# EAGLE design Oled v1.0 (EAGLE 5.10)
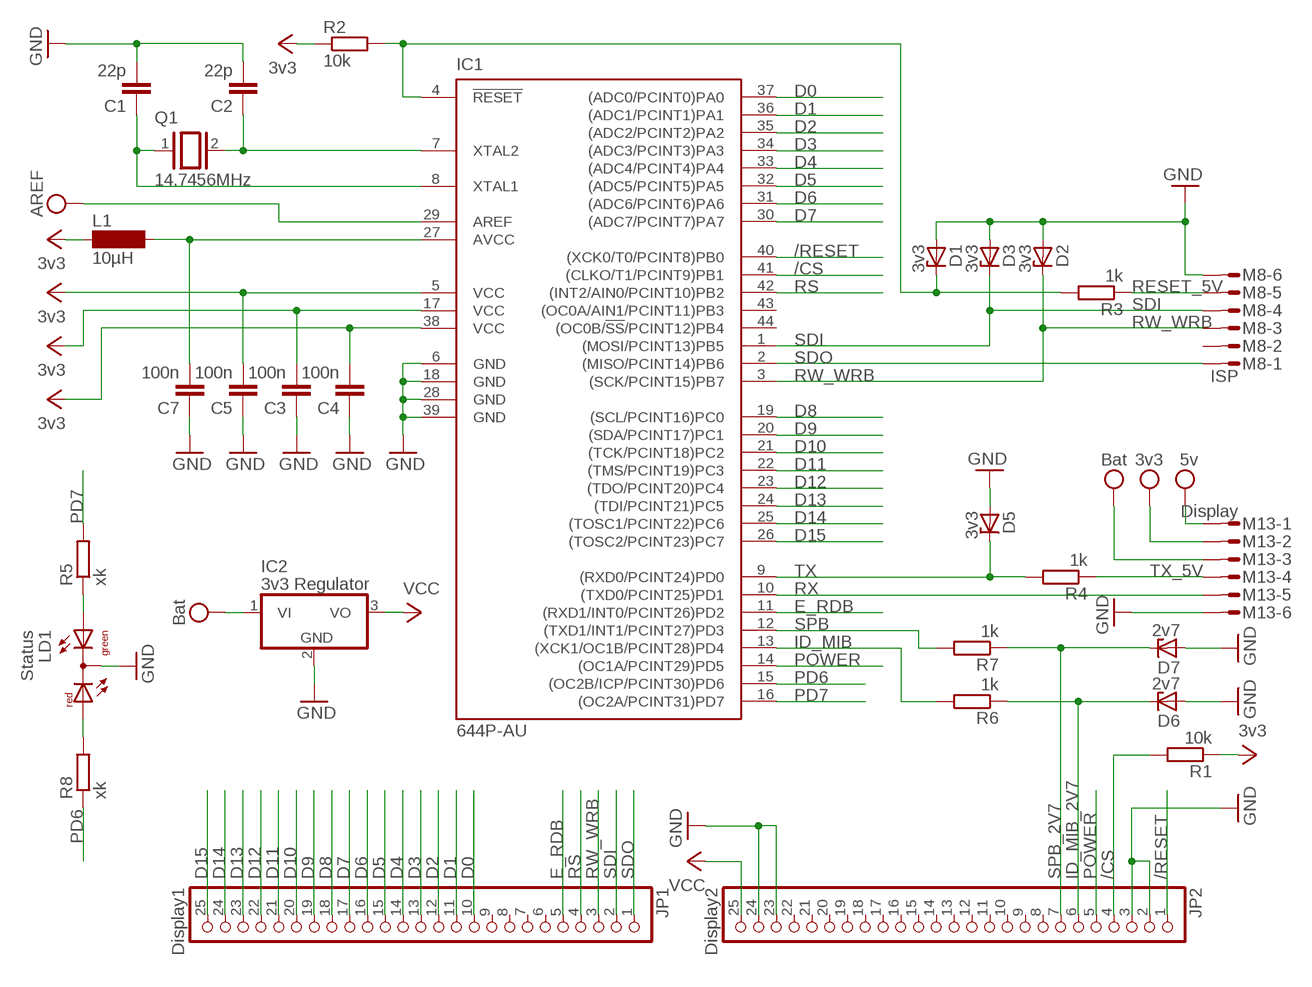
[diagram p0: schematic, sheet 1]

## Parts
C1  22p  C-EUC0603  [C0603]
C2  22p  C-EUC0603  [C0603]
C3  100n  C-EUC0603  [C0603]
C4  100n  C-EUC0603  [C0603]
C5  100n  C-EUC0603  [C0603]
C7  100n  C-EUC0603  [C0603]
D1  3v3  ZENER-DIODESOT23  [SOT23]
D2  3v3  ZENER-DIODESOT23  [SOT23]
D3  3v3  ZENER-DIODESOT23  [SOT23]
D5  3v3  ZENER-DIODESOT23  [SOT23]
D6  2v7  ZENER-DIODESOT23  [SOT23]
D7  2v7  ZENER-DIODESOT23  [SOT23]
IC1  644P-AU  MEGA164P/324P/644P-AU  [TQFP44]
IC2  3v3 Regulator  7805T  [TO220H]
JP1  Display1  PINHD-1X25  [1X25]
JP2  Display2  PINHD-1X25  [1X25]
L1  10µH  SM-1206  [SM-1206]
LD1  Status  DUOLED-RG-C  [DUOLED-C-5MM]
M8  ISP  MICROMATCH-6  [MICROMATCH-6]
M13  Display  MICROMATCH-6  [MICROMATCH-6]
Q1  14.7456MHz  XTAL/S  [QS]
R1  10k  R-EU_R0603  [R0603]
R2  10k  R-EU_R0603  [R0603]
R3  1k  R-EU_R0603  [R0603]
R4  1k  R-EU_R0603  [R0603]
R5  xk  R-EU_R0603  [R0603]
R6  1k  R-EU_R0603  [R0603]
R7  1k  R-EU_R0603  [R0603]
R8  xk  R-EU_R0603  [R0603]

## Nets
3V3: C3.2 C4.2 C5.2 IC1.5(VCC) IC1.17(VCC) IC1.38(VCC) L1.1 M13.2 R1.1 R2.1 ; supply symbol labelled 3v3
5V: M13.1 ; supply symbol labelled 5v
/CS: IC1.41((CLKO/T1/PCINT9)PB1) JP2.4 R1.2
/RESET: IC1.40((XCK0/T0/PCINT8)PB0) JP2.1
AREF: IC1.29(AREF)
AVCC: C7.2 IC1.27(AVCC) L1.2
BAT: IC2.1(VI) M13.3 ; supply symbol labelled Bat
D0: IC1.37((ADC0/PCINT0)PA0) JP1.10
D1: IC1.36((ADC1/PCINT1)PA1) JP1.11
D2: IC1.35((ADC2/PCINT2)PA2) JP1.12
D3: IC1.34((ADC3/PCINT3)PA3) JP1.13
D4: IC1.33((ADC4/PCINT4)PA4) JP1.14
D5: IC1.32((ADC5/PCINT5)PA5) JP1.15
D6: IC1.31((ADC6/PCINT6)PA6) JP1.16
D7: IC1.30((ADC7/PCINT7)PA7) JP1.17
D8: IC1.19((SCL/PCINT16)PC0) JP1.18
D9: IC1.20((SDA/PCINT17)PC1) JP1.19
D10: IC1.21((TCK/PCINT18)PC2) JP1.20
D11: IC1.22((TMS/PCINT19)PC3) JP1.21
D12: IC1.23((TDO/PCINT20)PC4) JP1.22
D13: IC1.24((TDI/PCINT21)PC5) JP1.23
D14: IC1.25((TOSC1/PCINT22)PC6) JP1.24
D15: IC1.26((TOSC2/PCINT23)PC7) JP1.25
E_RDB: IC1.11((RXD1/INT0/PCINT26)PD2) JP1.5
GND: C1.2 C2.2 C3.1 C4.1 C5.1 C7.1 D1.1(A) D2.1(A) D3.1(A) D5.1(A) D6.1(A) D7.1(A) IC1.6(GND) IC1.18(GND) IC1.28(GND) IC1.39(GND) IC2.2(GND) JP2.2 JP2.3 JP2.23 JP2.24 LD1.C M8.6 M13.6
ID_MIB: IC1.13((XCK1/OC1B/PCINT28)PD4) R6.2
ID_MIB_2V7: D6.3(C) JP2.6 R6.1
N$1: LD1.AR R8.2
N$2: LD1.AX(AG) R5.1
PD6: IC1.15((OC2B/ICP/PCINT30)PD6) R8.1
PD7: IC1.16((OC2A/PCINT31)PD7) R5.2
POWER: IC1.14((OC1A/PCINT29)PD5) JP2.5
RESET: D1.3(C) IC1.4(!RESET) R2.2 R3.2
RESET_5V: M8.5 R3.1
RS: IC1.42((INT2/AIN0/PCINT10)PB2) JP1.4
RW_WRB: D2.3(C) IC1.3((SCK/PCINT15)PB7) JP1.3 M8.3
RX: IC1.10((TXD0/PCINT25)PD1) M13.5
SDI: D3.3(C) IC1.1((MOSI/PCINT13)PB5) JP1.2 M8.4
SDO: IC1.2((MISO/PCINT14)PB6) JP1.1 M8.1
SPB: IC1.12((TXD1/INT1/PCINT27)PD3) R7.2
SPB_2V7: D7.3(C) JP2.7 R7.1
TX: D5.3(C) IC1.9((RXD0/PCINT24)PD0) R4.2
TX_5V: M13.4 R4.1
VCC: IC2.3(VO) JP2.25
XTAL1: C1.1 IC1.8(XTAL1) Q1.1
XTAL2: C2.1 IC1.7(XTAL2) Q1.2
Unconnected: IC1.43((OC0A/AIN1/PCINT11)PB3) IC1.44((OC0B/!SS!/PCINT12)PB4) JP1.6 JP1.7 JP1.8 JP1.9 JP2.8 JP2.9 JP2.10 JP2.11 JP2.12 JP2.13 JP2.14 JP2.15 JP2.16 JP2.17 JP2.18 JP2.19 JP2.20 JP2.21 JP2.22 M8.2

## Library data of the parts
C1-C5 C7 = resistor:C-EU: CAPACITOR, European symbol
D1-D3 D5-D7 = diode:ZENER-DIODE: Z-Diode
IC1 = avr-6:MEGA164P/324P/644P-AU
IC2 = pst-dimension-engineering:78*: Positive VOLTAGE REGULATOR Source: http://cache.national.com/ds/LM/LM78L05.pdf http://www.fairchildsemi.com/ds/LM/LM7805.pdf
JP1 JP2 = pinhead:PINHD-1X25: PIN HEADER
L1 = inductor-neosid:SM-1206: INDUCTOR SMD chip inductor
LD1 = led:DUOLED-RG-C: DUO LED 2 colors (red/green), 5 mm, round, common Cathode www.ligitek.com or other producers.
M8 M13 = con-amp-micromatch:MICROMATCH-6: MicroMaTch 6 7-215464-6 / 0-215464-6 Drawing Number C-215464 DDEController.pdf
Q1 = special:XTAL/S: CRYSTAL
R1-R8 = resistor:R-EU_: RESISTOR, European symbol

## Board
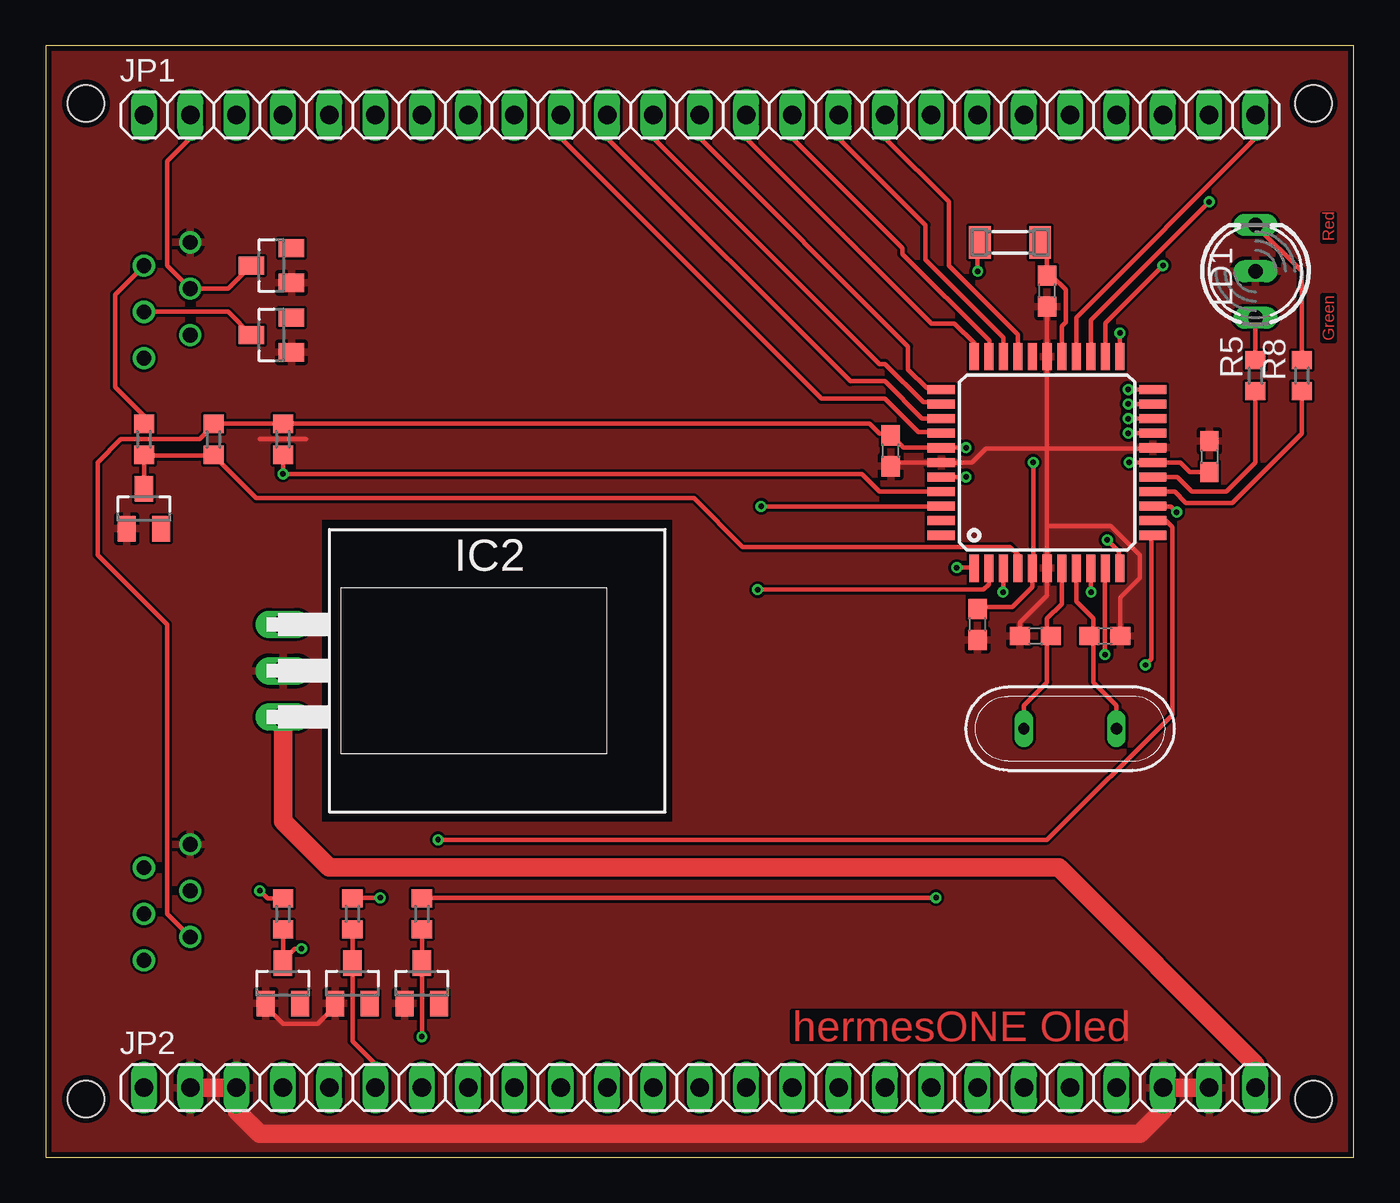
[diagram p1: board, top side]
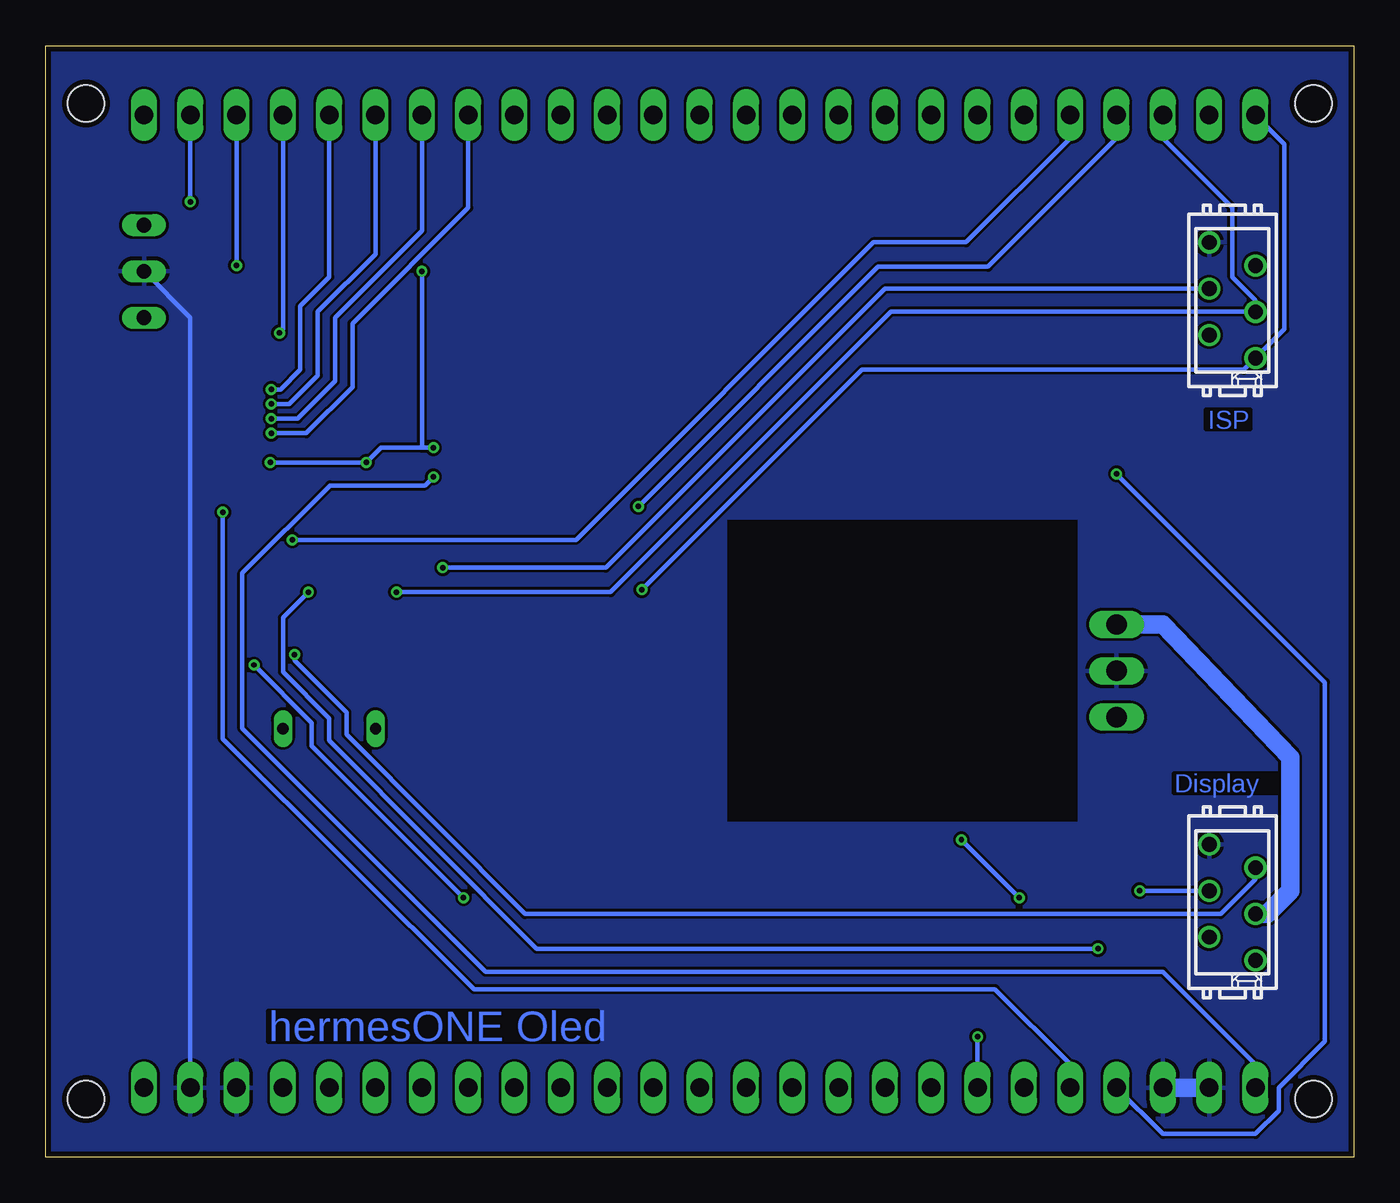
[diagram p2: board, bottom side, seen from below]

Size 71.75 x 60.96 mm. Coordinates in mm from the lower left corner, seen from the top.
Outline: 0,0 71.75,0 71.75,60.96 0,60.96 0,0
Copper layers (1*16): Top 0.035mm / dielectric 1.5mm / Bottom 0.035mm
Design rules "PCB-POOL Standard *": minimum track width 10mil, minimum drill 0.3mm, track to track 0.15mm, track to pad 0.15mm, pad to pad 0.15mm, via to via 0.15mm, smd to smd 0.15mm, copper to edge 0.3mm, drill to drill 0.2mm, minimum pad ring 0.2mm, minimum via ring 0.15mm, stop-mask expansion 0.075mm, vias tented up to drill 0mil, thermal gap 0.2mm
Holes 2 mm at 2.22,57.78 2.22,3.17 69.53,3.17 69.53,57.78
tRestrict: area 15.2,18.4 to 34.4,34.9
bRestrict: area 15.2,18.4 to 34.4,34.9

### Footprints (pad centres in the part's own frame; a part is rotated, then mirrored left to right if it is on the bottom)
C0603 = smd 1.1 x 1: 1 -0.85,0; 2 0.85,0
SOT23 = smd 1 x 1.4: 1 -0.95,-1.1; 2 0.95,-1.1; 3 0,1.1
TQFP44 = smd 1.5 x 0.5: 1 -5.8,4; 2 -5.8,3.2; 3 -5.8,2.4; 4 -5.8,1.6; 5 -5.8,0.8; 6 -5.8,0; 7 -5.8,-0.8; 8 -5.8,-1.6; 9 -5.8,-2.4; 10 -5.8,-3.2; 11 -5.8,-4; 23 5.8,-4; 24 5.8,-3.2; 25 5.8,-2.4; 26 5.8,-1.6; 27 5.8,-0.8; 28 5.8,0; 29 5.8,0.8; 30 5.8,1.6; 31 5.8,2.4; 32 5.8,3.2; 33 5.8,4 | smd 0.5 x 1.5: 12 -4,-5.8; 13 -3.2,-5.8; 14 -2.4,-5.8; 15 -1.6,-5.8; 16 -0.8,-5.8; 17 0,-5.8; 18 0.8,-5.8; 19 1.6,-5.8; 20 2.4,-5.8; 21 3.2,-5.8; 22 4,-5.8; 34 4,5.8; 35 3.2,5.8; 36 2.4,5.8; 37 1.6,5.8; 38 0.8,5.8; 39 0,5.8; 40 -0.8,5.8; 41 -1.6,5.8; 42 -2.4,5.8; 43 -3.2,5.8; 44 -4,5.8
TO220H = drill 1.118 long: 1 -2.54,-10.16; 2 0,-10.16; 3 2.54,-10.16
1X25 = drill 1.016 long: 1 -29.21,0; 2 -26.67,0; 3 -24.13,0; 4 -21.59,0; 5 -19.05,0; 6 -16.51,0; 7 -13.97,0; 8 -11.43,0; 9 -8.89,0; 10 -6.35,0; 11 -3.81,0; 12 -1.27,0; 13 1.27,0; 14 3.81,0; 15 6.35,0; 16 8.89,0; 17 11.43,0; 18 13.97,0; 19 16.51,0; 20 19.05,0; 21 21.59,0; 22 24.13,0; 23 26.67,0; 24 29.21,0; 25 31.75,0
SM-1206 = smd 1.2 x 1.8: 1 -1.65,0; 2 1.65,0
DUOLED-C-5MM = drill 0.813 long: AR 2.54,0; AX -2.54,0; C 0,0
MICROMATCH-6 = drill 0.813 round: 1 3.175,1.27; 2 1.905,-1.27; 3 0.635,1.27; 4 -0.635,-1.27; 5 -1.905,1.27; 6 -3.175,-1.27
QS = drill 0.61 long: 1 -2.54,0; 2 2.54,0
R0603 = smd 1 x 1.1: 1 -0.85,0; 2 0.85,0

### Placement (x,y rotation side)
C1  58.1,28.57 0 top
C2  54.29,28.57 180 top
C3  63.82,38.42 270 top
C4  46.35,38.73 90 top
C5  51.12,29.21 90 top
C7  54.93,47.5 90 top
D1  5.4,35.56 0 top
D2  12.38,45.09 90 top
D3  12.38,48.9 90 top
D5  13.02,9.53 0 top
D6  16.83,9.53 0 top
D7  20.64,9.53 0 top
IC1  54.93,38.1 90 top
IC2  23.18,26.67 270 top
JP1  34.61,57.15 0 top
JP2  34.61,3.81 0 top
L1  52.9,50.16 0 top
LD1  66.36,48.58 90 top
M8  6.67,46.99 270 bottom
M13  6.67,13.97 270 bottom
Q1  56.2,23.5 180 top
R1  13.02,39.37 270 top
R2  9.21,39.37 270 top
R3  5.4,39.37 270 top
R4  13.02,13.34 270 top
R5  66.36,42.86 270 top
R6  16.83,13.34 90 top
R7  20.64,13.34 90 top
R8  68.9,42.86 90 top

### Tracks (layer width: path | path; a pad name or v marks a point on that pad's centre or on a via)
3V3  (via drill 0.3)
  Top 0.254: 51.22,30.16 53.02,30.16 54.13,31.27 IC1.5 54.17,32.38 v54.17,38.1 | 51.24,49.66 L1.1 51.12,49.53 v51.12,48.58 | C3.2 62.76,37.57 62.23,38.1 v59.44,38.1 IC1.17 | M13.2 6.67,13.34 6.67,29.21 2.86,33.02 2.86,38.1 4.13,39.37 8.45,39.37 9.21,40.13 R2.1 R1.1 45.19,40.22 45.72,39.69 46.25,39.69 C4.2 47.04,38.9 IC1.38 49.89,38.9 v50.48,38.9
  Top 0.406: 51.22,30.16 C5.2
  Bottom 0.254: v50.48,38.9 51.12,38.9 | 51.12,38.9 v51.12,48.58 | v59.44,38.1 v54.17,38.1 53.37,38.9 51.12,38.9
/CS  (via drill 0.3)
  Top 0.254: R1.2 v13.02,37.47 44.77,37.47 45.72,36.51 49.12,36.51 IC1.41
  Bottom 0.254: JP2.4 10.48,1.27 5.4,1.27 4.13,2.54 4.13,3.81 1.59,6.35 1.59,26.04 v13.02,37.47
/RESET  (via drill 0.3)
  Top 0.254: IC1.40 50.33,37.3 v50.48,37.3
  Bottom 0.254: JP2.1 5.4,5.08 10.48,10.16 47.62,10.16 60.96,23.5 60.96,32.03 56.16,36.83 50.95,36.83 v50.48,37.3
AVCC
  Top 0.254: IC1.27 55.73,45.57 55.94,45.78 55.94,47.56 55.16,48.35 C7.2 54.93,49.78
  Top 0.406: 54.93,49.78 L1.2
BAT
  Bottom 1.016: M13.3 4.76,13.34 3.49,14.61 3.49,21.91 10.48,29.21 IC2.1
D0
  Top 0.254: IC1.37 49.09,39.75 47.88,39.75 46.04,41.59 42.55,41.59 28.26,55.88 JP1.10
D1
  Top 0.254: IC1.36 49.09,40.51 48.07,40.51 46.04,42.55 44.13,42.55 30.8,55.88 JP1.11
D2
  Top 0.254: IC1.35 49.09,41.4 48.13,41.4 46.04,43.5 45.72,43.5 33.34,55.88 JP1.12
D3
  Top 0.254: 49.09,42.16 IC1.34 48.96,42.16 48.32,42.16 47.31,43.18 47.31,44.45 35.88,55.88 JP1.13
D4
  Top 0.254: JP1.14 38.42,55.88 48.58,45.72 49.85,45.72 50.93,44.64 IC1.33
D5
  Top 0.254: JP1.15 40.96,55.88 46.99,49.85 46.99,49.53 51.75,44.77 51.75,43.92 IC1.32
D6
  Top 0.254: JP1.16 43.5,55.88 48.26,51.12 48.26,49.21 52.53,44.95 IC1.31
D7
  Top 0.254: JP1.17 46.04,55.88 49.53,52.39 49.53,48.9 53.33,45.1 IC1.30
D8  (via drill 0.3)
  Top 0.254: v59.37,39.7 IC1.19
  Bottom 0.254: JP1.18 48.58,52.07 54.93,45.72 54.93,42.23 57.45,39.7 v59.37,39.7
D9  (via drill 0.3)
  Top 0.254: 60.77,40.51 IC1.20 v59.37,40.5
  Bottom 0.254: JP1.19 51.12,50.8 55.88,46.04 55.88,42.55 57.92,40.5 v59.37,40.5
D10  (via drill 0.3)
  Top 0.254: 60.77,41.4 IC1.21 v59.37,41.3
  Bottom 0.254: JP1.20 53.66,49.53 56.83,46.35 56.83,42.86 58.4,41.3 v59.37,41.3
D11  (via drill 0.3)
  Top 0.254: 60.77,42.16 IC1.22 v59.37,42.1
  Bottom 0.254: JP1.21 56.2,48.26 57.78,46.67 57.78,43.18 58.87,42.1 v59.37,42.1
D12  (via drill 0.3)
  Top 0.254: IC1.23 v58.93,45.2
  Bottom 0.254: v58.93,45.2 58.74,45.4 JP1.22
D13  (via drill 0.3)
  Top 0.254: IC1.24 58.13,45.74 v61.28,48.9
  Bottom 0.254: v61.28,48.9 JP1.23
D14  (via drill 0.3)
  Top 0.254: IC1.25 57.33,45.9 v63.82,52.39
  Bottom 0.254: v63.82,52.39 JP1.24
D15
  Top 0.254: IC1.26 56.53,46.05 66.36,55.88 JP1.25
E_RDB  (via drill 0.3)
  Top 0.254: IC1.11 58.86,32.26 58.86,33.21 v58.23,33.85
  Bottom 0.254: JP1.5 15.56,55.88 21.27,50.16 26.35,50.16 42.67,33.85 v58.23,33.85
GND
  Top 0.254: C2.2 53.44,29.31 54.93,30.8 IC1.6 54.93,34.61 | IC1.28 C7.1 | IC1.28 54.93,43.31 | D6.1 15.81,8.38 15.81,8.19 14.92,7.3 13.02,7.3 12.07,8.25 D5.1 | JP2.3 10.86,4.06 | D1.1 4.51,34.42 | IC1.18 60.64,38.86 51.56,38.86 50.8,38.1 IC1.39 46.57,38.1 C4.1 | D2.1 13.02,44.45 | C1.2 58.95,30.7 60.01,31.75 60.01,33.02 58.42,34.61 54.93,34.61 | 54.93,34.61 IC1.28 | 11.75,39.37 14.29,39.37 | 19.62,8.38 19.68,8.38 D7.1 19.62,8.38
  Top 1.016: JP2.24 JP2.23 61.28,2.54 60.01,1.27 11.75,1.27 10.48,2.54 JP2.3 JP2.2
  Bottom 0.254: JP2.24 63.82,46.04 LD1.C
  Bottom 1.016: JP2.2 JP2.3
  pour Top: 0,60.96 0,0 71.75,0 71.75,60.96
  pour Bottom: 0,60.96 71.75,60.96 71.75,0 0,0
ID_MIB  (via drill 0.3)
  Top 0.254: v18.35,14.22 16.83,14.22 R6.2 | v21.53,17.4 54.93,17.4 61.78,24.26 61.78,34.54 61.43,34.9 IC1.13
  Bottom 0.254: v18.35,14.22 v21.53,17.4
ID_MIB_2V7
  Top 0.254: R6.1 D6.3 16.83,6.35 18.1,5.08 JP2.6
N$1
  Top 0.254: R8.2 68.9,48.58 LD1.AR
N$2
  Top 0.254: R5.1 LD1.AX
PD6
  Top 0.254: IC1.15 61.92,36.5 62.55,35.88 65.09,35.88 68.9,39.69 R8.1
PD7
  Top 0.254: IC1.16 62.08,37.3 62.87,36.51 64.77,36.51 66.36,38.1 R5.2
POWER  (via drill 0.3)
  Top 0.254: IC1.14 60.77,35.69 61.72,35.69 v62.04,35.37
  Bottom 0.254: v62.04,35.37 62.04,22.92 48.26,9.21 19.68,9.21 15.56,5.08 JP2.5
RESET
  Top 0.254: D1.3 5.4,38.48 | 5.4,38.48 9.21,38.48 | 5.4,38.48 R3.2 | 9.21,38.48 11.56,36.13 35.56,36.13 38.23,33.47 52.9,33.47 53.34,33.02 53.34,32.31 IC1.4 53.28,32.26 | 9.21,38.48 R2.2
RESET_5V
  Top 0.254: R3.1 5.4,40.64 3.81,42.23 3.81,47.31 M8.5
RS  (via drill 0.3)
  Top 0.254: v39.24,35.69 49.09,35.69 IC1.42
  Bottom 0.254: JP1.4 13.02,55.88 20.07,48.83 26.1,48.83 v39.24,35.69
RW_WRB  (via drill 0.3)
  Top 0.254: 52.51,32.38 IC1.3 52.53,31 v52.51,30.99 | M8.3 10.01,46.35 D2.3
  Bottom 0.254: JP1.3 10.48,55.88 6.67,52.07 6.67,48.26 5.4,46.99 M8.3 25.4,46.35 40.77,30.99 v52.51,30.99
RX  (via drill 0.3)
  Top 0.254: v58.1,27.56 58.1,32.26 IC1.10
  Bottom 0.254: v58.1,27.56 58.1,27.24 55.24,24.38 55.24,23.18 45.47,13.34 7.3,13.34 5.4,15.24 M13.5
SDI  (via drill 0.3)
  Top 0.254: IC1.1 50.86,32.38 50.8,32.32 v49.97,32.32 | D3.3 10.01,47.62 M8.4 6.67,48.9 6.67,54.61 7.94,55.88 JP1.2
  Bottom 0.254: M8.4 25.72,47.62 41.02,32.32 v49.97,32.32
SDO  (via drill 0.3)
  Top 0.254: IC1.2 51.73,31.41 51.44,31.11 v39.05,31.11
  Bottom 0.254: JP1.1 3.81,55.56 3.81,45.4 M8.1 6.03,43.18 26.99,43.18 v39.05,31.11
SPB  (via drill 0.3)
  Top 0.254: v48.83,14.22 20.64,14.22 R7.2 | v60.33,26.99 60.64,27.3 60.64,34.04 IC1.12
  Bottom 0.254: v48.83,14.22 57.15,22.54 57.15,23.81 v60.33,26.99
SPB_2V7  (via drill 0.3)
  Top 0.254: R7.1 D7.3 v20.64,6.6
  Bottom 0.254: JP2.7 v20.64,6.6
TX  (via drill 0.3)
  Top 0.254: R4.2 13.02,10.79 | v57.34,30.99 57.34,32.26 IC1.9 | 13.02,10.79 13.65,11.43 v14.03,11.43 | 13.02,10.79 D5.3
  Bottom 0.254: v14.03,11.43 44.83,11.43 56.2,22.86 56.2,24.07 58.74,26.61 58.74,29.59 v57.34,30.99
TX_5V  (via drill 0.3)
  Top 0.254: R4.1 12.17,14.19 v11.75,14.61
  Bottom 0.254: M13.4 v11.75,14.61
VCC
  Top 1.016: IC2.3 13.02,18.41 15.56,15.88 55.56,15.88 66.36,5.08 JP2.25
XTAL1
  Top 0.254: Q1.1 58.74,24.77 57.47,26.04 57.47,28.36 | IC1.8 56.53,30.47 57.47,29.53 57.47,28.79
  Top 0.406: 57.47,28.36 C1.1 57.47,28.79
XTAL2
  Top 0.254: Q1.2 53.66,24.77 54.93,26.04 54.93,28.36 | IC1.7 55.73,30.33 54.93,29.53 54.93,28.79
  Top 0.406: 54.93,28.36 C2.1 54.93,28.79

### Text on the board
Top: Red | Green | hermesONE Oled
Bottom: ISP | Display | hermesONE Oled
tValues: Bat | GND | 3v3